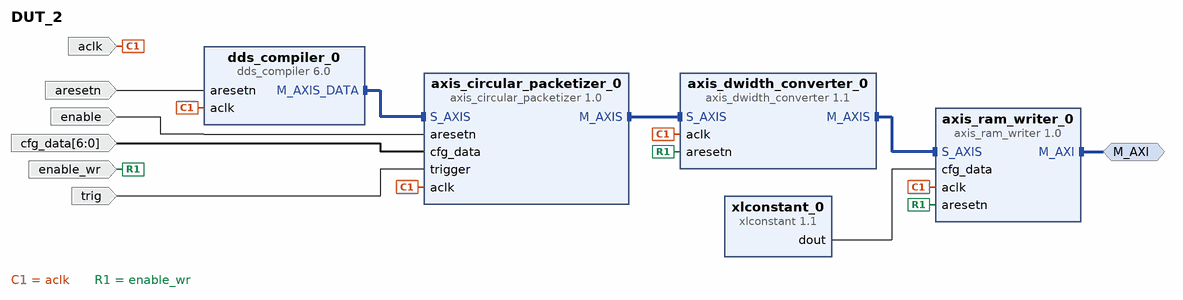
[diagram p0: block diagram of the top level]
# Vivado block design DUT_2, Vivado 2015.4
create_bd_design DUT_2

create_bd_intf_port -mode Master -vlnv xilinx.com:interface:aximm_rtl:1.0 M_AXI
set_property -dict [list \
  CONFIG.DATA_WIDTH 64 \
  CONFIG.PROTOCOL AXI3 \
  CONFIG.FREQ_HZ 125000000 \
  CONFIG.ADDR_WIDTH 32 \
  CONFIG.READ_WRITE_MODE WRITE_ONLY \
  CONFIG.HAS_BURST 0 \
  CONFIG.HAS_LOCK 0 \
  CONFIG.HAS_PROT 0 \
  CONFIG.HAS_CACHE 0 \
  CONFIG.HAS_QOS 0 \
  CONFIG.HAS_REGION 0 \
  CONFIG.HAS_BRESP 0 \
  CONFIG.HAS_RRESP 0 \
  CONFIG.NUM_READ_OUTSTANDING 2 \
  CONFIG.NUM_WRITE_OUTSTANDING 2 \
  CONFIG.CLK_DOMAIN DUT_aclk \
] [get_bd_intf_ports M_AXI]
create_bd_port -dir I -type clk aclk
set_property -dict [list \
  CONFIG.FREQ_HZ 125000000 \
  CONFIG.CLK_DOMAIN DUT_aclk \
  CONFIG.ASSOCIATED_RESET enable:aresetn:enable_wr \
] [get_bd_ports aclk]
create_bd_port -dir I -type rst enable
create_bd_port -dir I trig
create_bd_port -dir I -from 6 -to 0 cfg_data
create_bd_port -dir I -type rst aresetn
create_bd_port -dir I -type rst enable_wr

create_bd_cell -type ip -vlnv xilinx.com:ip:dds_compiler:6.0 dds_compiler_0
set_property -dict [list \
  CONFIG.DDS_Clock_Rate 125 \
  CONFIG.Parameter_Entry Hardware_Parameters \
  CONFIG.Noise_Shaping None \
  CONFIG.Phase_Width 32 \
  CONFIG.Output_Width 14 \
  CONFIG.Has_Phase_Out false \
  CONFIG.Has_TREADY true \
  CONFIG.M_DATA_Has_TUSER Not_Required \
  CONFIG.Latency 9 \
  CONFIG.Has_ARESETn true \
  CONFIG.Output_Frequency1 0 \
  CONFIG.PINC1 1000000000000000000000000000000 \
] [get_bd_cells dds_compiler_0]
create_bd_cell -type ip -vlnv pavel-demin:user:axis_circular_packetizer:1.0 axis_circular_packetizer_0
set_property -dict {CONFIG.CNTR_WIDTH 7} [get_bd_cells axis_circular_packetizer_0]
create_bd_cell -type ip -vlnv xilinx.com:ip:axis_dwidth_converter:1.1 axis_dwidth_converter_0
set_property -dict {CONFIG.S_TDATA_NUM_BYTES 4 CONFIG.M_TDATA_NUM_BYTES 8} [get_bd_cells axis_dwidth_converter_0]
create_bd_cell -type ip -vlnv pavel-demin:user:axis_ram_writer:1.0 axis_ram_writer_0
set_property -dict {CONFIG.ADDR_WIDTH 6} [get_bd_cells axis_ram_writer_0]
create_bd_cell -type ip -vlnv xilinx.com:ip:xlconstant:1.1 xlconstant_0
set_property -dict {CONFIG.CONST_WIDTH 32 CONFIG.CONST_VAL 268435456} [get_bd_cells xlconstant_0]

# ---- connections ----

connect_bd_intf_net [get_bd_intf_pins axis_circular_packetizer_0/S_AXIS] [get_bd_intf_pins dds_compiler_0/M_AXIS_DATA]
connect_bd_intf_net [get_bd_intf_pins axis_dwidth_converter_0/S_AXIS] [get_bd_intf_pins axis_circular_packetizer_0/M_AXIS]
connect_bd_intf_net [get_bd_intf_pins axis_ram_writer_0/S_AXIS] [get_bd_intf_pins axis_dwidth_converter_0/M_AXIS]
connect_bd_intf_net [get_bd_intf_ports M_AXI] [get_bd_intf_pins axis_ram_writer_0/M_AXI]
connect_bd_net [get_bd_ports aclk] \
  [get_bd_pins dds_compiler_0/aclk] [get_bd_pins axis_circular_packetizer_0/aclk] [get_bd_pins axis_dwidth_converter_0/aclk] \
  [get_bd_pins axis_ram_writer_0/aclk]
connect_bd_net [get_bd_ports aresetn] [get_bd_pins dds_compiler_0/aresetn]
connect_bd_net [get_bd_ports enable] [get_bd_pins axis_circular_packetizer_0/aresetn]
connect_bd_net [get_bd_ports cfg_data] [get_bd_pins axis_circular_packetizer_0/cfg_data]
connect_bd_net [get_bd_ports trig] [get_bd_pins axis_circular_packetizer_0/trigger]
connect_bd_net -net aresetn_1_1 [get_bd_ports enable_wr] [get_bd_pins axis_dwidth_converter_0/aresetn] [get_bd_pins axis_ram_writer_0/aresetn]
connect_bd_net [get_bd_pins xlconstant_0/dout] [get_bd_pins axis_ram_writer_0/cfg_data]

# ---- address map ----
assign_bd_address -offset 0x00000000 -range 512M -target_address_space [get_bd_addr_spaces axis_ram_writer_0/M_AXI] [get_bd_addr_segs M_AXI/Reg]

validate_bd_design
save_bd_design
